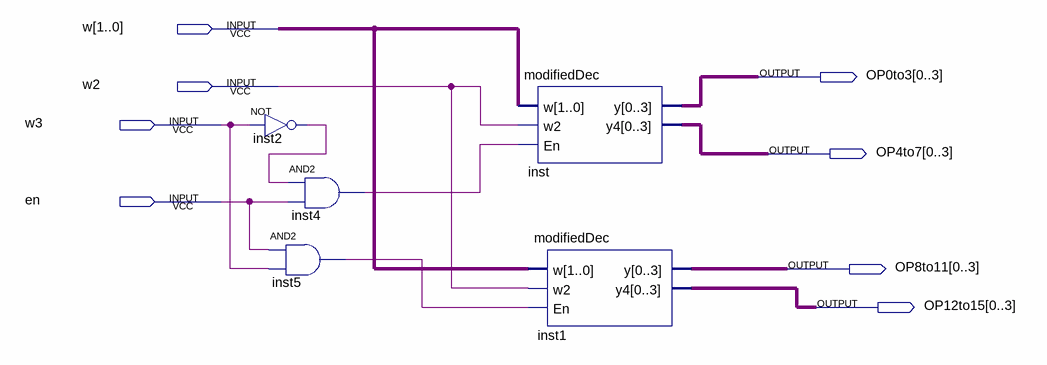
[diagram p0: schematic sheet]
// Quartus schematic ControlUnit.bdf as structural Verilog: 5 symbols, 8 pins
module ControlUnit (
  input  [1:0] w,
  input  w2,
  input  w3,
  input  en,
  output [0:3] OP0to3,
  output [0:3] OP4to7,
  output [0:3] OP8to11,
  output [0:3] OP12to15
);

  wire inst2_out, inst4_out, inst5_out;

  not inst2 (inst2_out, w3);
  and inst5 (inst5_out, en, w3);
  and inst4 (inst4_out, inst2_out, en);
  modifiedDec inst (.w(w), .w2(w2), .En(inst4_out), .y(OP0to3), .y4(OP4to7));
  modifiedDec inst1 (.w(w), .w2(w2), .En(inst5_out), .y(OP8to11), .y4(OP12to15));
endmodule
